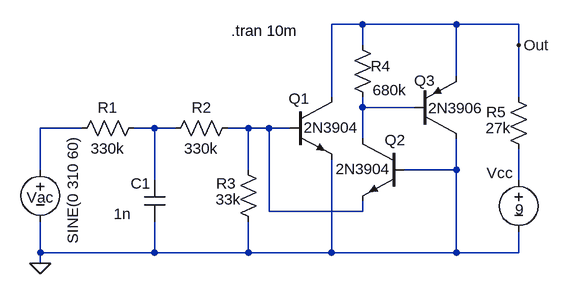
[diagram p0: schematic 3qDetX0.asc]
3qDetX0.asc, the LTspice schematic file:
Version 4
SHEET 1 880 680
WIRE -160 272 -160 208
WIRE -160 400 -160 352
WIRE -160 416 -160 400
WIRE -96 208 -160 208
WIRE 16 208 -16 208
WIRE 16 288 16 208
WIRE 16 400 -160 400
WIRE 16 400 16 352
WIRE 48 208 16 208
WIRE 160 208 128 208
WIRE 160 272 160 208
WIRE 160 400 16 400
WIRE 160 400 160 352
WIRE 192 208 160 208
WIRE 192 336 192 208
WIRE 224 208 192 208
WIRE 288 160 288 48
WIRE 288 400 160 400
WIRE 288 400 288 256
WIRE 336 48 288 48
WIRE 336 80 336 48
WIRE 336 176 336 160
WIRE 336 224 336 176
WIRE 336 336 192 336
WIRE 336 336 336 320
WIRE 416 176 336 176
WIRE 480 48 336 48
WIRE 480 128 480 48
WIRE 480 272 400 272
WIRE 480 272 480 224
WIRE 480 400 288 400
WIRE 480 400 480 272
WIRE 576 48 480 48
WIRE 576 80 576 48
WIRE 576 160 576 80
WIRE 576 288 576 240
WIRE 576 400 480 400
WIRE 576 400 576 368
FLAG -160 416 0
FLAG 576 80 Out
SYMBOL voltage -160 256 R0
WINDOW 0 -21 59 Left 0
WINDOW 3 50 -36 VRight 0
WINDOW 123 0 0 Left 0
WINDOW 39 0 0 Left 0
SYMATTR InstName Vac
SYMATTR Value SINE(0 310 60)
SYMBOL res 0 192 R90
WINDOW 0 0 56 VBottom 0
WINDOW 3 32 56 VTop 0
SYMATTR InstName R1
SYMATTR Value 330k
SYMBOL res 144 192 R90
WINDOW 0 0 56 VBottom 0
WINDOW 3 32 56 VTop 0
SYMATTR InstName R2
SYMATTR Value 330k
SYMBOL cap 0 288 R0
WINDOW 0 -21 5 Left 0
WINDOW 3 -47 52 Left 0
SYMATTR InstName C1
SYMATTR Value 1n
SYMBOL res 144 256 R0
WINDOW 0 -33 37 Left 0
WINDOW 3 -34 62 Left 0
SYMATTR InstName R3
SYMATTR Value 33k
SYMBOL npn2 224 160 R0
WINDOW 0 -2 2 Left 0
WINDOW 3 21 47 Left 0
SYMATTR InstName Q1
SYMATTR Value 2N3904
SYMBOL npn2 400 224 M0
WINDOW 0 -2 2 Left 0
WINDOW 3 21 47 Left 0
SYMATTR InstName Q2
SYMATTR Value 2N3904
SYMBOL pnp2 416 224 M180
WINDOW 0 -1 89 Left 0
WINDOW 3 21 47 Left 0
SYMATTR InstName Q3
SYMATTR Value 2N3906
SYMBOL res 352 176 R180
WINDOW 0 -27 64 Left 0
WINDOW 3 -52 27 Left 0
SYMATTR InstName R4
SYMATTR Value 680k
SYMBOL res 560 144 R0
WINDOW 0 -34 39 Left 0
WINDOW 3 -35 64 Left 0
SYMATTR InstName R5
SYMATTR Value 27k
SYMBOL voltage 576 272 R0
WINDOW 0 -49 5 Left 0
WINDOW 3 8 61 Right 0
WINDOW 123 0 0 Left 0
WINDOW 39 0 0 Left 0
SYMATTR InstName Vcc
SYMATTR Value 9
TEXT 134 58 Left 0 !.tran 10m

The netlist it stands for:
* 3qDetX0.asc
Vac N001 0 SINE(0 310 60)
R1 N002 N001 330k
R2 N003 N002 330k
C1 N002 0 1n
R3 N003 0 33k
Q1 Out N003 0 0 2N3904
Q2 N004 0 N003 0 2N3904
Q3 0 N004 Out 0 2N3906
R4 N004 Out 680k
R5 Out N005 27k
Vcc N005 0 9
.model NPN NPN
.model PNP PNP
.lib standard.bjt
.tran 10m
.backanno
.end